# Altium schematic sheet I2C Real Time Clock.SchDoc: I2C Real Time Clock
size 292 x 193 mm; DocumentNumber: 38; SheetNumber: 13; SheetTotal: 28
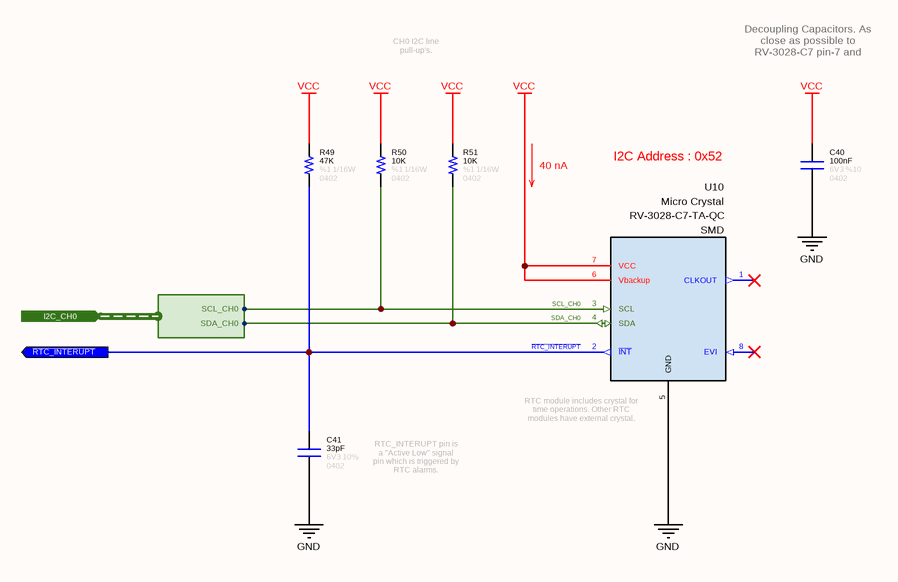
[diagram p0: I2C Real Time Clock.SchDoc]

## Parts
C40  value 100nF  Tolerance: %10  Voltage: 6V3  Case: 0402  [CAPACITOR_0402]  (hidden comment: Capacitor - 100nF [0402] (Ceramic))
C41  value 33pF  Tolerance: 10%  Case: 0402  Voltage: 6V3  [CAPACITOR_0402]  (hidden comment: Capacitor - 33pF [0402] (Ceramic))
R49  value 47K  Tolerance: %1  Case: 0402  Power: 1/16W  [RESISTOR_0402]  (hidden comment: 47K - 0402 - %1 - 1/16W)
R50  value 10K  Tolerance: %1  Case: 0402  Power: 1/16W  [RESISTOR_0402]  (hidden comment: 10K - 0402 - %1 - 1/16W)
R51  value 10K  Tolerance: %1  Case: 0402  Power: 1/16W  [RESISTOR_0402]  (hidden comment: 10K - 0402 - %1 - 1/16W)
U10  Manufacturer Name: Micro Crystal  Manufacturer Part Number: RV-3028-C7-TA-QC  Case: SMD  [RV-3028-C7]  (hidden comment: RV-3028-C7 32.768KHZ 1PPM TA QC)

## Ports
I2C_CH0 (in, harness I2C_CH0), ~{RTC_INTERUPT} (out)

## Harnesses
I2C_CH0: SDA_CH0, SCL_CH0

## Nets
GND: C40.1 C41.1 U10.5(GND)
VCC: C40.2 R49.2 R50.2 R51.2 U10.6(Vbackup) U10.7(VCC)
~{RTC_INTERUPT}: C41.2 R49.1 U10.2(~{INT}) ; port ~{RTC_INTERUPT}
SCL_CH0: R50.1 U10.3(SCL) ; port I2C_CH0.SCL_CH0
SDA_CH0: R51.1 U10.4(SDA) ; port I2C_CH0.SDA_CH0

Not connected (* = marked no-connect by the designer): U10 1(CLKOUT)* 8(EVI)*

## Notes on the sheet
- CH0 I2C line pull-up's.
- Decoupling Capacitors. As close as possible to RV-3028-C7 pin-7 and pin-6.
- 40 nA
- I2C Address : 0x52
- RTC_INTERUPT pin is a "Active Low" signal pin which is triggered by RTC alarms.
- (near U10) RTC module includes crystal for time operations. Other RTC modules have external crystal.
- © 2021 All rights reserved.
  This document may not, in whole or in part, be copied, photocopied, reproduced, translated or converted to any electronic or machine readable from without prior written permission of Mehmet Günce Akkoyun.
  Engineer contact : akkoyun@me.com
- Property of
- Engineer :
- Date :
- Size :
- A4
- Time :
- Project :
- Page :
- /
- Customer :
- Product ID :
- Module ID :
- Version :
- File :
- Revision :

## Library data of the parts
C40 = Capacitor - 100nF [0402-6V3]: Capacitor - 100nF [0402-6V3] (Ceramic); Manufacturer Name: AVX; Manufacturer Part Number: 04026D104KAT4A; ComponentLink1Description: Mouser; ComponentLink1URL: https://www.mouser.com.tr/ProductDetail/AVX/04026D104KAT4A?qs=sGAEpiMZZMs0AnBnWHyRQPg4iYkCw7IMED%2F4kpqgf7w%3D; ComponentLink2Description: DataSheet; ComponentLink2URL: https://www.mouser.com.tr/datasheet/2/40/cx5r-776519.pdf
C41 = Capacitor - 33pF [0402-6V3]: Manufacturer Name: Kemet; Manufacturer Part Number: C0402C330J9RACAUTO; ComponentLink1Description: DataSheet; ComponentLink1URL: https://api.kemet.com/component-edge/download/datasheet/C0402C330J9RACAUTO.pdf; ComponentLink2Description: Mouser; ComponentLink2URL: https://www.mouser.com/Search/Refine.aspx?Keyword=80-C0402C330J9RAUTO
R49 = Resistor - 47K [0402]: Thick Film Resistors - SMD 1/16 W 47 KOhm 1%; Manufacturer Name: Vishay; Manufacturer Part Number: CRCW040247K0FKED; ComponentLink1Description: DataSheet; ComponentLink1URL: https://www.mouser.com.tr/datasheet/2/427/dcrcwe3-1762152.pdf; ComponentLink2Description: Mouser; ComponentLink2URL: https://www.mouser.com.tr/ProductDetail/Vishay-Dale/CRCW040247K0FKED?qs=sGAEpiMZZMu61qfTUdNhG2DpbjADlD3GL%252B3h1elTxqU%3D
R50 R51 = Resistor - 10K [0402]: Thick Film Resistors - SMD 1/16 W 10 KOhm 1%; Manufacturer Name: Vishay; Manufacturer Part Number: CRCW040210K0FKED; ComponentLink1Description: DataSheet; ComponentLink1URL: https://www.mouser.com.tr/datasheet/2/427/dcrcwe3-1762152.pdf; ComponentLink2Description: Mouser; ComponentLink2URL: https://www.mouser.com.tr/ProductDetail/Vishay-Dale/CRCW040210K0FKED?qs=sGAEpiMZZMu61qfTUdNhG2DpbjADlD3GcalbOv9utCY%3D
U10 = IC - RV-3028-C7: IC Rtc Clk/calendar I2C 8-SMT; Supply Voltage - Max: 5.5 V; Supply Voltage - Min: 1.2 V; Product Type: Real Time Clocks; Minimum Operating Temperature: - 40 C; Maximum Operating Temperature: + 85 C